# EAGLE design emonDC v0.2 (EAGLE 7.7.0)
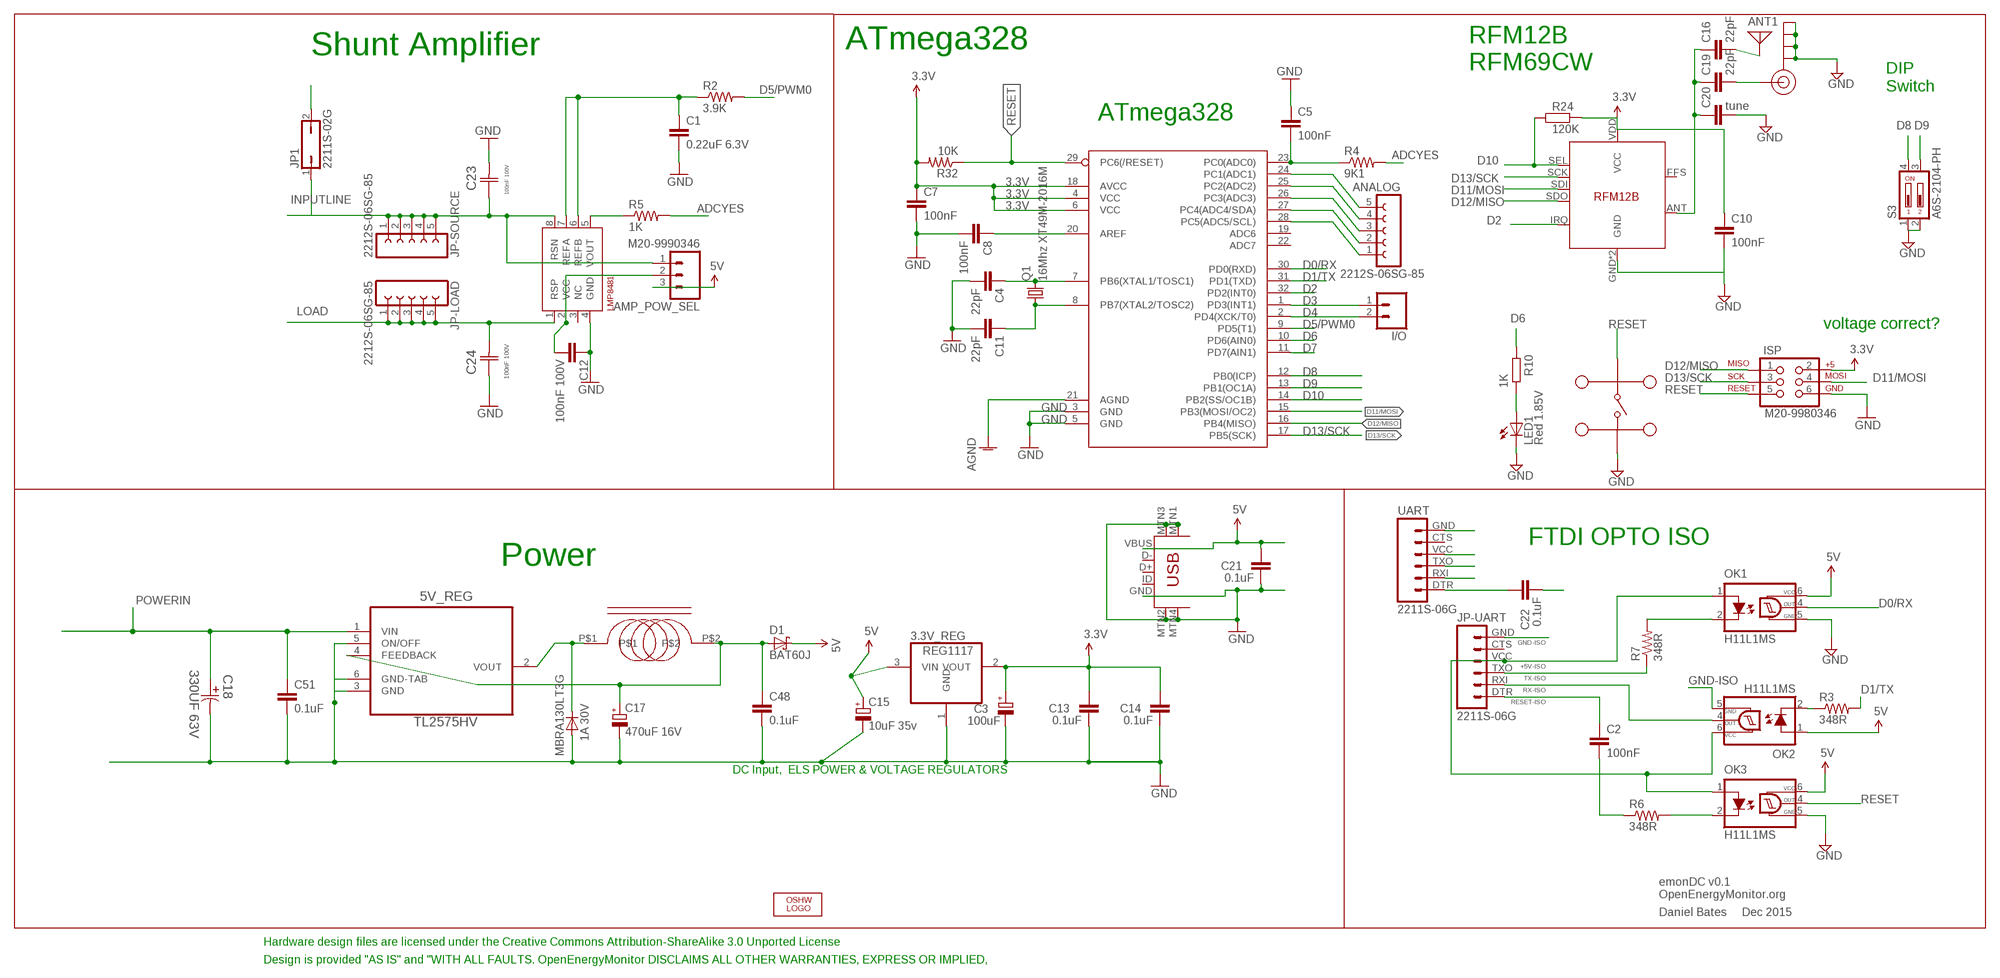
[diagram p0: schematic, sheet 1]

## Parts
3.3V_REG  REG1117  [SOT223]
5V_REG  TL2575HV  TL2575HV-05IKTTR  [TO-263]
AMP_POW_SEL  M20-9990346  M03SMD_RA_FEMALE_NOWRITE  [1X03_SMD_RA_FEMALE_NOWRITE]
ANALOG  2212S-06SG-85  FE05-1  [FE05-1]
ANT1  ANTENNA  [PAD-01]
C1  0.22uF 6.3V  C-EUC0402K  [C0402K]
C2  100nF  C-EUC0402K  [C0402K]
C3  100uF  CPOL-EU153CLV-0605  [153CLV-0605]
C4  22pF  C-EUC0603  [C0603]
C5  100nF  C-EUC0402K  [C0402K]
C7  100nF  C-EUC0402K  [C0402K]
C8  100nF  C-EUC0402K  [C0402K]
C10  100nF  C-EUC0402K  [C0402K]
C11  22pF  C-EUC0603  [C0603]
C12  100nF 100V  C-EUC0805K  [C0805K]
C13  0.1uF  C-EUC0805K  [C0805K]
C14  0.1uF  C-EUC0805K  [C0805K]
C15  10uF 35v  CPOL-EUE1.8-4  [E1,8-4]
C16  22pF  C-EUC0603  [C0603]
C17  470uF 16V  CPOL-EUE3.5-8  [E3,5-8]
C18  330UF 63V  ECA1JHG331-D10XP5  [CAPPR500-1000X2000]
C19  22pF  C-EUC0603  [C0603]
C20  tune  C-EUC0603  [C0603]
C21  0.1uF  C-EUC0805K  [C0805K]
C22  0.1uF  C-EUC0805K  [C0805K]
C23  100nF 100V  T0603F104ZCT  [CAPC1608X85N]
C24  100nF 100V  T0603F104ZCT  [CAPC1608X85N]
C48  0.1uF  C-EUC0805K  [C0805K]
C51  0.1uF  C-EUC0805  [C0805]
D1  BAT60J  [SOD323_ST]
D2  MBRA130LT3G  [DO-214]
I1  SRR0603-331KL  [SRR0603-331KL]
I/O  2212S-02SG-85  M02LOCK  [1X02_LOCK]
ISP  M20-9980346  AVR_SPI_PRG_6PTH  [2X3]
J$1  SMA_EDGE  [SMA-EDGE]
JP1  2211S-02G  JP1Q  [JP1]
JP-LOAD  2212S-06SG-85  FE05-1  [FE05-1]
JP-SOURCE  2212S-06SG-85  FE05-1  [FE05-1]
JP-UART  2211S-06G  FTDI_BASICPTH  [FTDI_BASIC]
LED1  Red 1.85V  LEDCHIP-LED0805  [CHIP-LED0805]
LMP8481  LMP8481SMCLMP8481  [S-PDSO-G08]
LOGO1  OSHW_LOGO_6MILX0200-NT  [OSHW_6X200_NOTEXT]
OK1  H11L1MS  [DIL6-SMD]
OK2  H11L1MS  [DIL6-SMD]
OK3  H11L1MS  [DIL6-SMD]
Q1  16Mhz XT49M-2016M  CRYSTALHC49UP  [HC49UP]
R2  3.9K  R-US_R0603  [R0603]
R3  348R  R-US_R0603  [R0603]
R4  9K1  R-US_R0603  [R0603]
R5  1K  R-US_R0603  [R0603]
R6  348R  R-US_R0603  [R0603]
R7  348R  R-US_R0603  [R0603]
R10  1K  R-EU_R0603  [R0603]
R24  120K  R-EU_R0603  [R0603]
R32  10K  R-US_R0603  [R0603]
RF  RFM12B  [RFM12B]
S3  A6S-2104-PH  2_SMT_DIP_SWITCH  [DIP_SWITCH_SMT]
U1_TQFP  ATMEGA328P  ATMEGA328_SMT  [TQFP32-08]
U$1  MC32882  [SWITCH_TACT_MULTICOMP]
UART  2211S-06G  FTDI_BASICPTH  [FTDI_BASIC]
USB  MUSB-05-S-B-SM-A  USB-MINIB-5PIN  [USB-MINIB-CISECO]

## Nets
3.3V: 3.3V_REG.2(VOUT) C3.+ C7.1 C10.1 C13.1 C14.1 ISP.2 R24.2 R32.2 RF.VDD(VCC) U1_TQFP.4(VCC) U1_TQFP.6(VCC) U1_TQFP.18(AVCC)
5VHIGH [power]: 5V_REG.4(FEEDBACK) C17.+ C48.1 D1.A I1.P$2
5VLOW [power]: 3.3V_REG.3(VIN) AMP_POW_SEL.3 C15.+ C21.1 D1.C OK1.6(VCC) OK2.1(A) OK3.6(VCC) UART.VCC USB.VBUS ; supply symbol labelled 5V
+5V-ISO [power]: JP-UART.VCC OK1.1(A) OK2.6(VCC) OK3.1(A)
ADC1: ANALOG.5 U1_TQFP.24(PC1(ADC1))
ADC2: ANALOG.4 U1_TQFP.25(PC2(ADC2))
ADC3: ANALOG.3 U1_TQFP.26(PC3(ADC3))
ADC4: ANALOG.2 U1_TQFP.27(PC4(ADC4/SDA))
ADC5: ANALOG.1 U1_TQFP.28(PC5(ADC5/SCL))
ADCYES: R4.2 R5.2
AGND [thin_power]: U1_TQFP.21(AGND)
D0/RX: OK1.4(OUT) U1_TQFP.30(PD0(RXD)) UART.TXO
D1/TX: R3.2 U1_TQFP.31(PD1(TXD)) UART.RXI
D2: RF.IRQ U1_TQFP.32(PD2(INT0))
D3: I/O.1 U1_TQFP.1(PD3(INT1))
D4: I/O.2 U1_TQFP.2(PD4(XCK/T0))
D5/PWM0: R2.2 U1_TQFP.9(PD5(T1))
D6: R10.2 U1_TQFP.10(PD6(AIN0))
D7: U1_TQFP.11(PD7(AIN1))
D8: S3.4 U1_TQFP.12(PB0(ICP))
D9: S3.3 U1_TQFP.13(PB1(OC1A))
D9/PWM1: C1.1 LMP8481.6(REFB) LMP8481.7(REFA) R2.1
D10: R24.1 RF.SEL U1_TQFP.14(PB2(SS/OC1B))
D11/MOSI: ISP.4 RF.SDI U1_TQFP.15(PB3(MOSI/OC2))
D12/MISO: ISP.1 RF.SDO U1_TQFP.16(PB4(MISO))
D13/SCK: ISP.3 RF.SCK U1_TQFP.17(PB5(SCK))
DIG1: C16.1 C19.1 C20.1 RF.ANT
GND [thin_power]: 3.3V_REG.1(GND) 5V_REG.3(GND) 5V_REG.5(ON/OFF) 5V_REG.6(GND-TAB) C1.2 C3.- C4.2 C5.1 C7.2 C8.2 C10.2 C11.2 C12.1 C13.2 C14.2 C15.- C17.- C18.2 C20.2 C21.2 C23.2(C2) C24.1(C1) C48.2 C51.2 D2.P$2(A) ISP.6 J$1.GND@0(GND) J$1.GND@1(GND) J$1.GND@2(GND) J$1.GND@3(GND) LED1.C LMP8481.4(GND) OK1.5(GND) OK3.5(GND) RF.GND RF.P$12(GND) S3.1 S3.2 U1_TQFP.3(GND) U1_TQFP.5(GND) U$1.P$3 U$1.P$4 UART.GND USB.GND USB.MTN1(MTN2) USB.MTN2(MTN3) USB.MTN3(MTN1) USB.MTN4
GND-ISO [thin_power]: JP-UART.GND OK2.5(GND)
IND: 5V_REG.2(VOUT) D2.P$1(C) I1.P$1
INPUTLINE: AMP_POW_SEL.1 C23.1(C1) JP1.1 JP-SOURCE.1 JP-SOURCE.2 JP-SOURCE.3 JP-SOURCE.4 JP-SOURCE.5 LMP8481.8(RSN)
LOAD: C24.2(C2) JP-LOAD.1 JP-LOAD.2 JP-LOAD.3 JP-LOAD.4 JP-LOAD.5 LMP8481.1(RSP)
N$1: C4.1 Q1.2 U1_TQFP.7(PB6(XTAL1/TOSC1))
N$2: C5.2 R4.1 U1_TQFP.23(PC0(ADC0))
N$3: C22.1 UART.DTR
N$6: LMP8481.5(VOUT) R5.1
N$7: AMP_POW_SEL.2 C12.2 LMP8481.2(VCC)
N$9: C11.1 Q1.1 U1_TQFP.8(PB7(XTAL2/TOSC2))
N$10: C2.1 JP-UART.DTR
N$11: ANT1.1 C16.2
N$13: OK1.2(C) R7.2
N$15: OK2.2(C) R3.1
N$17: OK3.2(C) R6.2
N$20: C8.1 U1_TQFP.20(AREF)
N$24: C19.2 J$1.SIG(SIGNAL)
N$41: LED1.A R10.1
POWERIN: 5V_REG.1(VIN) C18.1 C51.1 JP1.2
RESET: C22.2 ISP.5 OK3.4(OUT) R32.1 U1_TQFP.29(PC6(/RESET)) U$1.P$1 U$1.P$2
RESET-ISO: C2.2 R6.1
RX-ISO: JP-UART.RXI OK2.4(OUT)
TX-ISO: JP-UART.TXO R7.1
Unconnected: JP-UART.CTS LMP8481.3(NC) RF.FFS U1_TQFP.19(ADC6) U1_TQFP.22(ADC7) UART.CTS USB.D+ USB.D- USB.ID

## Notes on the sheet
- Shunt Amplifier | ATmega328
- RFM12B
  RFM69CW
- DIP
  Switch
- ATmega328
- voltage correct?
- FTDI OPTO ISO
- Power
- DC Input,  ELS POWER & VOLTAGE REGULATORS
- emonDC v0.1
  OpenEnergyMonitor.org
- Daniel Bates     Dec 2015
- Hardware design files are licensed under the Creative Commons Attribution-ShareAlike 3.0 Unported License
- Design is provided "AS IS" and "WITH ALL FAULTS. OpenEnergyMonitor DISCLAIMS ALL OTHER WARRANTIES, EXPRESS OR IMPLIED,

## Library data of the parts
3.3V_REG = burr-brown:REG1117: 800mA and 1A Low Dropout (LDO) Positive Regulator 1.8V, 2.5V, 2.85V, 3.3V, 5V, and Adj; MF: TEXAS INSTRUMENTS; MPN: REG1117; OC_FARNELL: 1097566; OC_NEWARK: 14P6981
5V_REG = TL2575HV:TL2575HV; MF: TEXAS INSTRUMENTS; MPN: LM2575HVS-15/NOPB; OC_FARNELL: 2492609
AMP_POW_SEL = SparkFun-Connectors:M03: Header 3 Standard 3-pin 0.1" header. Use with straight break away headers (SKU : PRT-00116), right angle break away headers (PRT-00553), swiss pins (PRT-00743), machine pins (PRT-00117), and female headers (PRT-00115). Molex polarized connector foot print use with SKU : PRT-08232 with associated crimp pins and housings.; MF: HARWIN; MPN: M20-9990346; OC_FARNELL: 1022249
ANALOG JP-LOAD JP-SOURCE = con-lsta:FE05-1: FEMALE HEADER; MF: MULTICOMP; MPN: 2212S-06SG-85; OC_FARNELL: 1593462; OC_NEWARK: unknown
ANT1 = discrete:ANTENNA: Antenna; OC_FARNELL: unknown
C1 = rcl:C-EU: CAPACITOR, European symbol; MF: AVX; MPN: 04026D224KAT2A; OC_FARNELL: 1327659
C2 C5 C7 C8 C10 = rcl:C-EU: CAPACITOR, European symbol; MF: WALSIN; MPN: 0402X104K100CT; OC_FARNELL: 2496809
C3 = resistor:CPOL-EU: POLARIZED CAPACITOR, European symbol; MF: NICHICON; MPN: UWX0J101MCL1GB; OC_FARNELL: 1823603
C4 C11 = resistor:C-EU: CAPACITOR, European symbol; MF: YAGEO (PHYCOMP); MPN: CC0402JRNPO9BN470; OC_FARNELL: 3019202
C12 = rcl:C-EU: CAPACITOR, European symbol; MF: AVX; MPN: 08051C104K4Z2A; OC_FARNELL: 1833851
C13 C14 C21 C22 C48 = rcl:C-EU: CAPACITOR, European symbol; MF: WALSIN; MPN: 0805B104K160CT; OC_FARNELL: 2496942
C15 = rcl:CPOL-EU: POLARIZED CAPACITOR, European symbol; MF: AVX; MPN: TAJD106K035RNJ; OC_FARNELL: 498956
C16 C19 = rcl:C-EU: CAPACITOR, European symbol; MF: YAGEO (PHYCOMP); MPN: CC0402JRNPO9BN470; OC_FARNELL: 3019202
C17 = rcl:CPOL-EU: POLARIZED CAPACITOR, European symbol; MF: RUBYCON; MPN: 16YXF470MEFC10X12.5; OC_FARNELL: 1144616
C18 = Panasonic-ECA_01:ECA: Aluminum Electrolytic Capacitors/Radial Lead Type; MF: PANASONIC ELECTRONIC COMPONENTS; MPN: ECA1JHG331; OC_FARNELL: unknown; OC_NEWARK: 96K9187; PACKAGE: Radial Lead-TH; SUPPLIER: PANASONIC; TOLERANCE: ±20 %; VALUE: 330UF; VOLTAGERATING: 63V
C20 = rcl:C-EU: CAPACITOR, European symbol; OC_FARNELL: unknown
C23 C24 = Multicomp_By_element14_Batch_1:T0603F104ZCT: CAPACITOR, 0603; MPN: T0603F104ZCT; OC_FARNELL: 9406204; OC_NEWARK: 38K9086; SUPPLIER: Multicomp; TOLERANCE: -20/+80%; VALUE: 100nF; VOLTAGERATING: 25V
C51 = resistor:C-EU: CAPACITOR, European symbol; MF: WALSIN; MPN: 0805B104K160CT; OC_FARNELL: 2496942
D1 = diode:BAT60J: Schottky barrier diode Source: www.st.com, BAT60J.pdf
D2 = CASE 403D Diode:MBRA130LT3G: Fast switching diode; MF: ON SEMICONDUCTOR; MPN: MBRA130LT3G; OC_FARNELL: 9555978
I1 = SRR0603-331KL:SRR0603-331KL: SRR0603-331KL; INDUCTANCE: 330uH; MF: BOURNS; MPN: SRR0603-331KL; OC_FARNELL: 2333890
I/O = SparkFun-Connectors:M02: Standard 2-pin 0.1" header. Use with - straight break away headers ( PRT-00116) - right angle break away headers (PRT-00553) - swiss pins (PRT-00743) - machine pins (PRT-00117) - female headers (PRT-00115) Molex polarized connector foot print use with: PRT-08233 with associated crimp pins and housings. 2.54_SCREWTERM for use with PRT-10571. 3.5mm Screw Terminal footprints for PRT-08084 5mm Screw Terminal footprints for use with PRT-08432; MF: MULTICOMP; MPN: 2212S-02SG-85; OC_FARNELL: 1593458
ISP = SparkFun:AVR_SPI_PRG_6: AVR ISP 6 Pin This is the reduced ISP connector for AVR programming. Common on Arduino. This footprint will take up less PCB space and can be used with a 10-pin to 6-pin adapter such as SKU: BOB-08508; MF: HARWIN; MPN: M20-9980346; OC_FARNELL: 1022231
J$1 = SparkFun-Connectors:SMA_EDGE: SMA Antenna Connector End launch SMA connector. The paste layer has been removed so that the connector can be hand soldered onto the board after reflow.; OC_FARNELL: unknown
JP1 = jumper:JP1Q: JUMPER; MF: MULTICOMP; MPN: 2211S-02G; OC_FARNELL: 1593411
JP-UART UART = SparkFun:FTDI_BASIC: FTDI Basic: 3.3V and 5V; MF: MULTICOMP; MPN: 2211S-06G; OC_FARNELL: 1593415
LED1 = adafruit:LED: LED OSRAM: - CHIPLED LG R971, LG N971, LY N971, LG Q971, LY Q971, LO R971, LY R971 LH N974, LH R974 LS Q976, LO Q976, LY Q976 LO Q996 - Hyper CHIPLED LW Q18S LB Q993, LB Q99A, LB R99A - SideLED LS A670, LO A670, LY A670, LG A670, LP A670 LB A673, LV A673, LT A673, LW A673 LH A674 LY A675 LS A676, LA A676, LO A676, LY A676, LW A676 LS A679, LY A679, LG A679 - Hyper Micro SIDELED® LS Y876, LA Y876, LO Y876, LY Y876 LT Y87S - SmartLED LW L88C, LW L88S LB L89C, LB L89S, LG L890 LS L89K, LO L89K, LY L89K LS L896, LA L896, LO L896, LY L896 - TOPLED LS T670, LO T670, LY T670, LG T670, LP T670 LSG T670, LSP T670, LSY T670, LOP T670, LYG T670 LG T671, LOG T671, LSG T671 LB T673, LV T673, LT T673, LW T673 LH T674 LS T676, LA T676, LO T676, LY T676, LB T676, LH T676, LSB T676, LW T676 LB T67C, LV T67C, LT T67C, LS T67K, LO T67K, LY T67K, LW E67C LS E67B, LA E67B, LO E67B, LY E67B, LB E67C, LV E67C, LT E67C LW T67C LS T679, LY T679, LG T679 LS T770, LO T770, LY T770, LG T770, LP T770 LB T773, LV T773, LT T773, LW T773 LH T774 LS E675, LA E675, LY E675, LS T675 LS T776, LA T776, LO T776, LY T776, LB T776 LHGB T686 LT T68C, LB T68C - Hyper Mini TOPLED® LB M676 - Mini TOPLED Santana® LG M470 LS M47K, LO M47K, LY M47K Source: http://www.osram.convergy.de/; MF: ROHM; MPN: SML-211UTT86K; OC_FARNELL: 1685056
LMP8481 = lmp8481b:LMP8481: LMP8481 - H; MF: TEXAS INSTRUMENTS; MPN: LMP8481MME-S/NOPB; OC_FARNELL: 2322044
LOGO1 = ohw-logo:OSHW_LOGO_6MIL; OC_FARNELL: unknown
OK1-OK3 = optocoupler:H11L*M: 6-Pin DIP Optocoupler Source: http://www.fairchildsemi.com/ds/H1/H11L2-M.pdf; OC_FARNELL: unknown; OC_NEWARK: unknown
Q1 = adafruit:CRYSTAL: CRYSTAL; MF: VISHAY; MPN: XT49M-2016M; OC_FARNELL: 1469641; OC_NEWARK: unknown
R2 = adafruit:R-US_: RESISTOR, American symbol; MF: VISHAY; MPN: CRCW06039K09FKEA; OC_FARNELL: 1152155
R3 R6 R7 = adafruit:R-US_: RESISTOR, American symbol; MF: MULTICOMP; MPN: MC0063W06031348R; OC_FARNELL: 1170742
R4 = adafruit:R-US_: RESISTOR, American symbol; MF: MULTICOMP; MPN: MC01W080559K1; OC_FARNELL: 9334955
R5 = adafruit:R-US_: RESISTOR, American symbol; MF: MULTICOMP; MPN: MC0063W060351K; OC_FARNELL: 9331697
R10 = rcl:R-EU_: RESISTOR, European symbol; MF: MULTICOMP; MPN: MC0063W060351K; OC_FARNELL: 9331697
R24 = rcl:R-EU_: RESISTOR, European symbol; MF: YAGEO (PHYCOMP); MPN: RC0603FR-07120KL; OC_FARNELL: 9238735
R32 = adafruit:R-US_: RESISTOR, American symbol; MF: MULTICOMP; MPN: MC0063W0603510K; OC_FARNELL: 9331700
RF = JeeParts:RFM12B; OC_FARNELL: unknown
S3 = OpenEnergyMonitor:2_SMT_DIP_SWITCH: Multicomp MCEMR-02-T 2 throw SMT DIP switch, Farnell 1524005; MF: OMRON ELECTRONIC COMPONENTS; MPN: A6S2104H; OC_FARNELL: 1960894
U1_TQFP = SparkFun-DigitalIC:ATMEGA328_SMT: 32-Pin Atmega328 part Commonly used on Arduino compatible boards Available in QFP and QFN packages TQFP is IC-09069 QFN is non-stock; MF: ATMEL; MPN: ATMEGA328-AU; OC_FARNELL: 1972086; PROD_ID: IC-09069
U$1 = multicomp tact switch:MC32882
USB = Ciseco USB miniB:USB-MINIB: Mini-USB "B" connector with 5th pin broken out. Created new symbol breaking out 5th "ID" pin in mini/micro USB connector spec. See: http://en.wikipedia.org/wiki/Mini_usb#Cables. Uses same footprint as 4-pin symbol. Also added pins to connect to mounting / shield pads if required (probably not generally needed as signals aren't shielded once they leave the connector). Modified by Ciseco for Rapid Part 24-0357; MF: MOLEX; MPN: 67503-1020; OC_FARNELL: 1125348

## Net classes
2 thin_power: width 0.254 mm

## Board
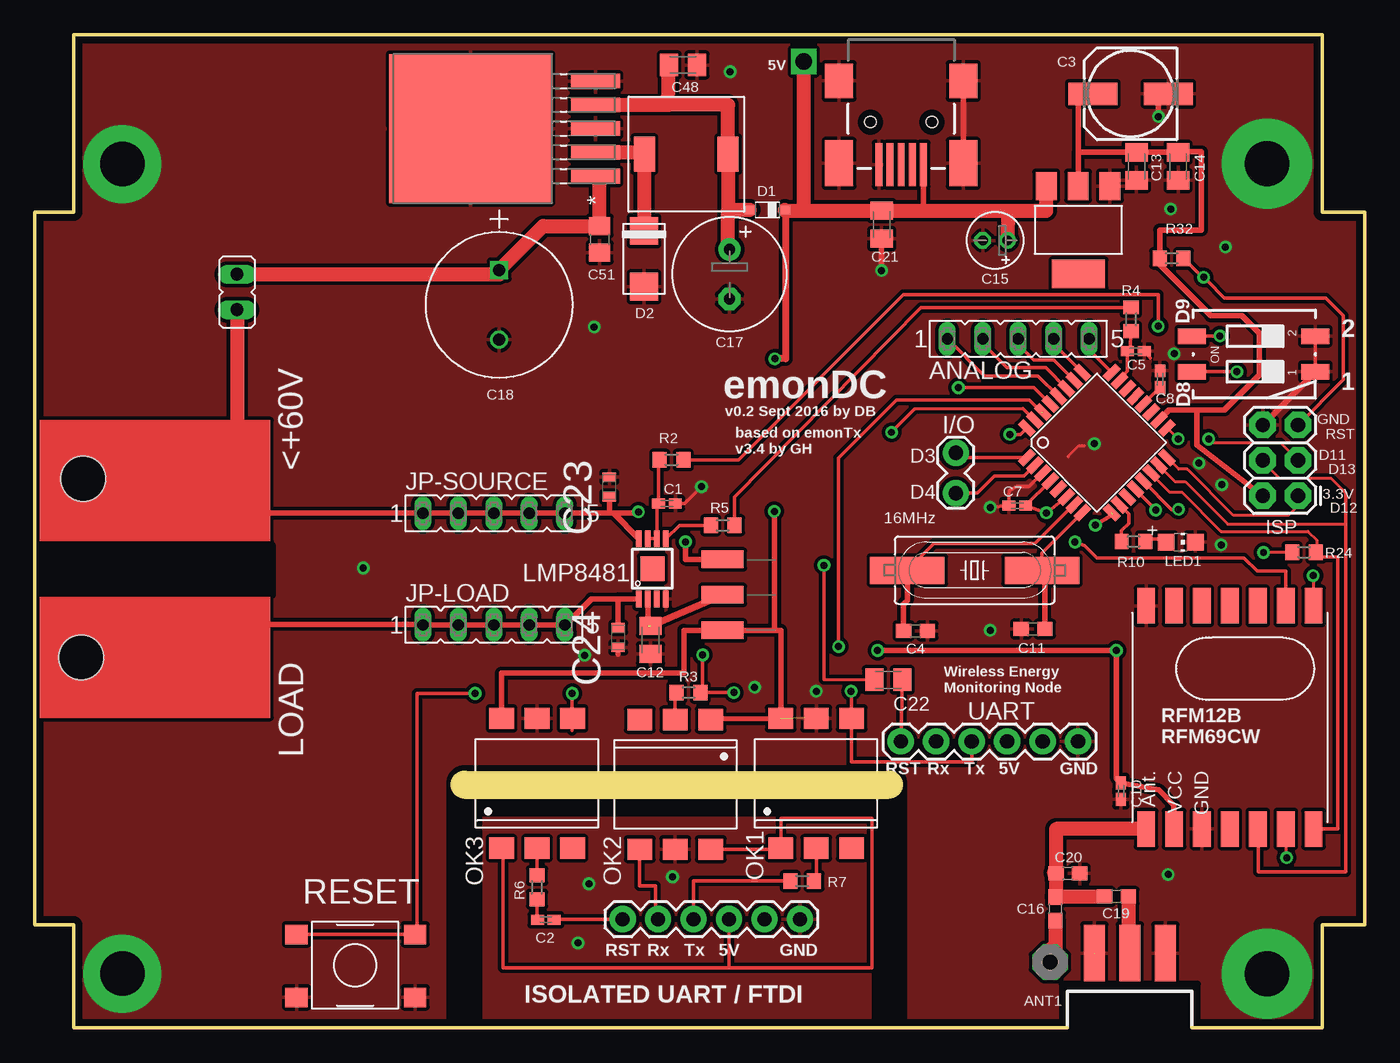
[diagram p1: board, top side]
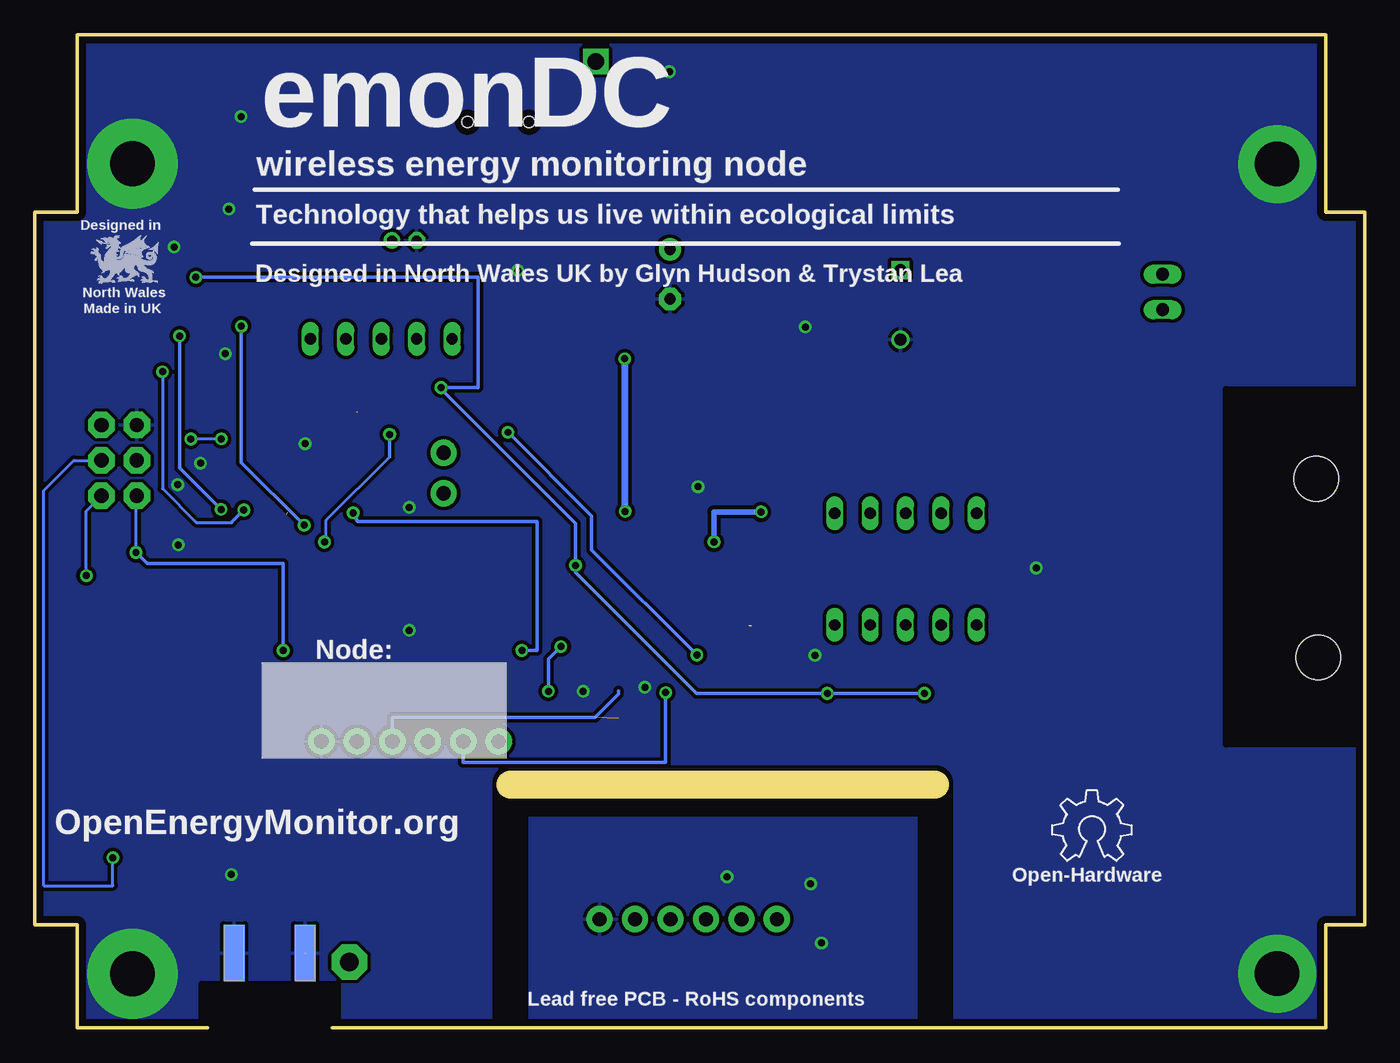
[diagram p2: board, bottom side, seen from below]

Size 95.25 x 71.12 mm. Coordinates in mm from the lower left corner, seen from the top.
Outline: 2.79,0 2.79,7.37 0,7.37 0,58.42 2.79,58.42 2.79,71.12 92.2,71.12 92.2,58.42 95.25,58.42 95.25,7.37 92.2,7.37 92.2,0
Outline: 92.21,0 82.87,0
Outline: 73.97,0 2.79,0
Copper layers (1*16): Top 0.0178mm / dielectric 59mil / Bottom 0.0178mm
Design rules "SSC-EAGLE-2Lyr_v1.0.0.3": minimum track width 6mil, minimum drill 14mil, track to track 6mil, track to pad 6mil, pad to pad 6mil, via to via 6mil, smd to smd 6mil, copper to edge 20mil, drill to drill 16mil, minimum pad ring 8mil, minimum via ring 8mil, stop-mask expansion 3mil, vias tented up to drill 0mil, thermal gap 10mil
Holes 3.2 mm at 3.45,39.32 3.33,26.52
tRestrict: area 0.3,31 to 17,34.5; area 73.6,0.3 to 83.3,3.1; 3 lines
bRestrict: area 0.3,34.8 to 7.1,43.4; area 0.3,22.4 to 7.1,30.7; area 0.3,20.3 to 9.9,45.7; area 73.6,0.3 to 83.3,3.1; 3 lines
Milling: 1 lines

### Footprints (pad centres in the part's own frame; a part is rotated, then mirrored left to right if it is on the bottom)
SOT223 = smd 1.499 x 2.007: 1 -2.261,-3.15; 2 0.025,-3.15; 3 2.311,-3.15 | smd 3.81 x 2.007: 4 0,3.15
TO-263 = smd 1.041 x 3.505: 1 -3.404,-8.788; 2 -1.702,-8.788; 3 0,-8.788; 4 1.702,-8.788; 5 3.404,-8.788 | smd 10.668 x 11.659: 6 0,0.152
1X03_SMD_RA_FEMALE_NOWRITE = smd 1.25 x 3: 1 -2.54,3.415; 2 0,3.415; 3 2.54,3.415
FE05-1 = drill 0.813 long: 1 -5.08,0; 2 -2.54,0; 3 0,0; 4 2.54,0; 5 5.08,0
PAD-01 = drill 1.321 pad 2.54 octagon: 1 0,0
C0402K = smd 0.925 x 0.74: 1 -0.6,0; 2 0.6,0
153CLV-0605 = smd 3.5 x 1.6: + 2.7,0; - -2.7,0
C0603 = smd 1.1 x 1: 1 -0.85,0; 2 0.85,0
C0805K = smd 1.3 x 1.6: 1 -1,0; 2 1,0
E1,8-4 = drill 0.711 pad 1.168: + -0.889,0 | drill 0.711 pad 1.168 octagon: - 0.889,0
E3,5-8 = drill 0.813 pad 1.6: + -1.778,0 | drill 0.813 pad 1.6 octagon: - 1.778,0
CAPPR500-1000X2000 = drill 0.864 square: 1 -5.004,0 | drill 0.864: 2 0,0
CAPC1608X85N = smd 0.66 x 0.94: 1 -0.711,0; 2 0.711,0
C0805 = smd 1.3 x 1.5: 1 -0.95,0; 2 0.95,0
SOD323_ST = smd 0.8 x 0.6: A 1.25,0; C -1.25,0
DO-214 = smd 2 x 2: P$1 -2,0; P$2 2,0
SRR0603-331KL = smd 1.5 x 2.5: P$1 -3,0; P$2 3,0
1X02_LOCK = drill 1.016 pad 1.88: 1 -0.178,0; 2 2.718,0
2X3 = drill 1.016 pad 1.88 octagon: 1 0,0; 2 0,2.54; 3 2.54,0; 4 2.54,2.54; 5 5.08,0; 6 5.08,2.54
SMA-EDGE = smd 1.524 x 4.064: GND@0 0,0; GND@1 5.08,0; SIG 2.54,0 | smd 1.524 x 4.064 bottom: GND@2 0,0; GND@3 5.08,0
JP1 = drill 0.914 long: 1 0,-1.27; 2 0,1.27
FTDI_BASIC = drill 1.016 pad 1.88: CTS 10.16,0; DTR 0,0; GND 12.7,0; RXI 2.54,0; TXO 5.08,0; VCC 7.62,0
CHIP-LED0805 = smd 1.2 x 1.2: A 0,-1.05; C 0,1.05
S-PDSO-G08 = smd 0.4 x 1.2: 1 -0.975,-2.157; 2 -0.325,-2.157; 3 0.325,-2.157; 4 0.975,-2.157; 5 0.975,2.157; 6 0.325,2.157; 7 -0.325,2.157; 8 -0.975,2.157 | smd 1.73 x 1.78: TH 0,0
DIL6-SMD = smd 1.78 x 1.52: 1 -2.54,-4.645; 2 0,-4.645; 3 2.54,-4.645; 4 2.54,4.645; 5 0,4.645; 6 -2.54,4.645
HC49UP = smd 5.334 x 1.93: 1 -4.826,0; 2 4.826,0
R0603 = smd 1 x 1.1: 1 -0.85,0; 2 0.85,0
RFM12B = smd 2.54 x 1.27: ANT 8,-6; FFS -8,2; GND 8,-2; IRQ -8,4; P$8 -8,0; P$9 -8,-2; P$10 -8,-4; P$12 -8,-6; P$16 8,0; SCK 8,4; SDI 8,2; SDO -8,6; SEL 8,6; VDD 8,-4
DIP_SWITCH_SMT = smd 1.1 x 2: 1 -1.27,-4.215; 2 1.27,-4.215; 3 1.27,4.615; 4 -1.27,4.615
TQFP32-08 = smd 1.27 x 0.559: 1 -4.293,2.8; 2 -4.293,2; 3 -4.293,1.2; 4 -4.293,0.4; 5 -4.293,-0.4; 6 -4.293,-1.2; 7 -4.293,-2; 8 -4.293,-2.8; 17 4.293,-2.8; 18 4.293,-2; 19 4.293,-1.2; 20 4.293,-0.4; 21 4.293,0.4; 22 4.293,1.2; 23 4.293,2; 24 4.293,2.8 | smd 0.559 x 1.27: 9 -2.8,-4.293; 10 -2,-4.293; 11 -1.2,-4.293; 12 -0.4,-4.293; 13 0.4,-4.293; 14 1.2,-4.293; 15 2,-4.293; 16 2.8,-4.293; 25 2.8,4.293; 26 2,4.293; 27 1.2,4.293; 28 0.4,4.293; 29 -0.4,4.293; 30 -1.2,4.293; 31 -2,4.293; 32 -2.8,4.293
SWITCH_TACT_MULTICOMP = smd 1.6 x 1.4: P$1 -1.1,5.3; P$2 7.4,5.3; P$3 -1.1,0.8; P$4 7.4,0.8
USB-MINIB-CISECO = smd 3.1 x 0.5: D+ 8.25,0; D- 8.25,0.8; GND 8.25,-1.6; ID 8.25,-0.8; VBUS 8.25,1.6 | smd 2.5 x 2: MTN1 2.25,4.45; MTN3 2.25,-4.45 | smd 3.3 x 2: MTN2 8.15,4.45; MTN4 8.15,-4.45 | hole 0.8: 5.2,2.2; 5.2,-2.2

### Placement (x,y rotation side)
3.3V_REG  74.76,57.15 180 top
5V_REG  31.36,64.4 90 top
AMP_POW_SEL  45.85,31 270 top
ANALOG  70.44,49.35 0 top
ANT1  72.72,4.7 0 top
C1  45.27,37.55 0 top
C2  36.59,7.73 180 top
C3  78.49,66.9 180 top
C4  63.08,28.42 0 top
C5  78.86,48.47 180 top
C7  70.37,37.4 180 top
C8  80.59,46.46 90 top
C10  77.8,16.95 270 top
C11  71.5,28.56 180 top
C12  44.1,27.77 90 top
C13  78.91,61.7 270 top
C14  81.89,61.7 270 top
C15  68.79,56.4 180 top
C16  73.1,8.51 270 top
C17  49.76,53.98 270 top
C18  33.25,49.28 270 top
C19  77.47,9.4 0 top
C20  73.99,11.05 0 top
C21  60.66,57.53 270 top
C22  61.14,24.92 180 top
C23  41.15,38.73 90 top
C24  41.78,27.94 90 top
C48  46.43,68.96 0 top
C51  40.45,56.48 270 top
D1  52.47,58.59 180 top
D2  43.63,55.08 270 top
I1  46.66,62.57 0 top
I/O  65.97,41 270 top
ISP  90.49,38.1 90 top
J$1  80.98,5.33 180 top
JP1  14.48,52.7 0 top
JP-LOAD  32.88,28.85 0 top
JP-SOURCE  32.88,36.85 0 top
JP-UART  42.1,7.77 0 top
LED1  82.08,34.77 270 top
LMP8481  44.23,32.87 0 top
LOGO1  22.37,11.94 0 bottom
OK1  55.97,17.5 0 top
OK2  45.87,17.43 180 top
OK3  35.97,17.5 0 top
Q1  67.31,32.77 180 top
R2  45.6,40.67 0 top
R3  46.82,24.01 0 top
R4  78.52,50.75 90 top
R5  49.27,35.99 0 top
R6  35.97,10.05 90 top
R7  54.97,10.5 0 top
R10  78.69,34.83 180 top
R24  90.92,34.05 180 top
R32  81.42,55.11 180 top
RF  85.6,22.23 270 top
S3  87.5,48.26 90 top
U1_TQFP  76.07,41.91 45 top
U$1  19.84,1.37 0 top
UART  62.03,20.5 0 top
USB  62.05,70.07 270 top

### Tracks (layer width: path | path; a pad name or v marks a point on that pad's centre or on a via)
3.3V  (via drill 0.5)  (1 unrouted)
  Top 0.203: R24.2 88.03,34.05 v88.01,34.04 | U1_TQFP.4 72.81,39.16 72.87,39.19 72.92,39.32 | 80.48,43.48 U1_TQFP.18 | 73.91,38 U1_TQFP.6
  Top 0.254: U1_TQFP.4 C7.1 v72.46,36.88 U1_TQFP.6 | R32.2 80.57,54.65 | 81.22,44.25 81.22,44.23 | v77.47,27.03 77.47,27
  Top 0.406: RF.VDD 81.6,15.94 80.52,17.02 C10.1 77.47,17.87 v77.47,27.03 v77.47,27.02 v60.37,27.02 | 73.89,38.07 U1_TQFP.6 | 80.57,54.65 84.22,51 86.47,51 87.72,49.75 87.72,46.75 85.22,44.25 83.22,44.25 | 83.22,44.25 81.22,44.25 | 81.22,44.23 U1_TQFP.18 | 3.3V_REG.2 74.73,62.7 | 74.73,62.7 C13.1 C14.1 81.39,62.75 83.56,62.75 83.57,57.15 80.57,57.15 R32.2 | C3.+ 74.73,66.9 74.73,62.7 | ISP.2 83.22,41.75 83.22,44.25
  Bottom 0.203: v88.01,34.04 88.01,38.04 ISP.2
  Bottom 0.254: v72.46,36.88 72.14,36.27 59.27,36.27 59.27,27.02 v60.37,27.02 | 87.99,34.04 87.2,33.25 77.47,33.25 v77.47,27.03
5VHIGH
  Top 1.016: 5V_REG.4 45.36,66.11 | 45.36,66.11 C48.1 | 45.36,66.11 49.66,66.11 I1.P$2 49.66,58.59 | 49.66,58.59 D1.A | C17.+ arc-90 49.66,55.85 49.66,58.59
5VLOW  (via drill 0.5, 1.2)  (1 unrouted)
  Top 0.406: USB.VBUS 63.65,58.53 64.01,58.53 | v52.97,37 v52.97,36.99 52.97,28.46 | 52.97,28.46 AMP_POW_SEL.3 46.48,28.46 46.48,25.4 33.43,25.4 OK3.6 | 52.97,28.46 53.43,28.46 OK1.6 48.53,22.13
  Top 0.5: 48.53,22.13 OK2.1
  Top 0.508: 53.78,58.53 53.78,47.91 v53,47.91
  Top 1.016: 55.07,58.53 55.27,58.53 | 55.27,58.53 C21.1 64.01,58.53 69.7,58.53 | 69.7,58.53 C15.+ | 69.7,58.53 72.44,58.53 3.3V_REG.3 | v55.07,69.22 55.07,58.53 | 55.27,58.59 55.27,58.53 | D1.C arc90 53.78,58.53 55.07,58.53
  Bottom 0.254: UART.VCC 69.65,22.23 55.12,22.23 53.43,23.91 53.43,24.13
  Bottom 0.508: v53,47.91 53,36.99 v52.97,36.99
+5V-ISO
  Top 0.254: JP-UART.VCC 49.72,4.27 | 49.72,4.27 33.53,4.27 33.53,12.8 OK3.1 | 49.72,4.27 59.94,4.27 59.94,14.99 53.43,14.99 OK1.1 53.45,12.79 OK2.6
ADC1
  Top 0.203: U1_TQFP.24
  Top 0.254: ANALOG.5 75.52,48.53 U1_TQFP.24
ADC2
  Top 0.203: U1_TQFP.25 75.02,46.9 74.93,46.99
  Top 0.254: U1_TQFP.25 72.98,48.96 ANALOG.4
ADC3
  Top 0.203: U1_TQFP.26 74.45,46.33 74.3,46.48
  Top 0.254: U1_TQFP.26 72.98,47.83 71.55,47.83 70.44,48.94 ANALOG.3
ADC4
  Top 0.203: U1_TQFP.27 73.89,45.75 73.79,45.85
  Top 0.254: U1_TQFP.27 72.41,47.27 69.62,47.27 67.9,48.99 ANALOG.2
ADC5
  Top 0.203: U1_TQFP.28 73.32,45.17 73.28,45.21
  Top 0.254: U1_TQFP.28 71.86,46.69 68.03,46.69 ANALOG.1
ADCYES
  Top 0.254: R4.2 63.47,51.6 50.12,38.02 R5.2
AGND
  Top 0.203: U1_TQFP.21 78.78,45.2 78.84,45.15
D0/RX  (via drill 0.5)  (1 unrouted)
  Top 0.203: 72.19,44.02 72.14,44.07
  Top 0.254: 72.14,44.07 71.26,44.95 61.72,44.95 57.57,40.8 v57.57,27.3 | v58.47,24.1 58.51,24.06 OK1.4 58.51,19.02 67.11,19.02 UART.TXO
  Bottom 0.254: v57.57,27.3 58.47,26.4 v58.47,24.1
D1/TX  (via drill 0.5)
  Top 0.254: v61.37,42.65 63.02,44.3 70.77,44.35 71.54,43.58 U1_TQFP.31 | v47.83,26.7 47.83,24.16 R3.2 v50.06,24
  Bottom 0.254: v61.37,42.65 55.37,36.65 55.37,34.23 v47.83,26.7 | UART.RXI 64.57,19 50.06,19 v50.06,24
D2  (via drill 0.5)
  Top 0.254: RF.IRQ 89.6,32.7 87.57,32.7 86.61,33.66 76.07,33.66 75.18,34.54 v74.51,34.79 | v69.84,42.5 70.59,42.5 U1_TQFP.32
  Bottom 0.203: 74.3,34.8 v74.51,34.79 74.42,34.67 74.42,36.32 69.85,40.9
  Bottom 0.254: v69.84,42.5 69.85,42.12 69.85,40.9
D3
  Top 0.254: U1_TQFP.1 66.29,40.85 I/O.1
D4
  Top 0.203: U1_TQFP.2 71.62,40.33 71.63,40.34
  Top 0.254: U1_TQFP.2 70.84,39.5 68.72,39.5 67.5,38.28 I/O.2
D5/PWM0  (via drill 0.5)  (1 unrouted)
  Top 0.203: 77.01,37.04 U1_TQFP.9
  Top 0.254: v75.97,36 77.22,36.75 | v80.47,50.25 80.47,52.5 62.23,52.5 50.41,40.67 R2.2
  Bottom 0.254: v75.97,36 80.47,40.5 v80.47,50.25
D6
  Top 0.254: U1_TQFP.10 78.37,36.79 78.37,36.12 77.84,35.6 R10.2
D7
  Top 0.203: U1_TQFP.11 78.26,38.07 78.21,38.08
D8  (via drill 0.5)
  Top 0.203: U1_TQFP.12 78.83,38.65 78.79,38.63
  Top 0.254: S3.4 v86.11,46.99 | U1_TQFP.12 78.83,38.55 v80.29,37.08
  Bottom 0.203: v86.11,46.99 86.11,38.61 83.69,36.2 81.15,36.2
  Bottom 0.254: v80.29,37.08 81.15,36.22 81.15,36.2
D9  (via drill 0.5)
  Top 0.203: U1_TQFP.13 79.39,39.23 79.38,39.14
  Top 0.254: S3.3 82.91,49.55 v84.89,49.55 | v81.92,37.13 81.41,37.13 U1_TQFP.13
  Bottom 0.254: v81.92,37.13 84.89,40.11 v84.89,49.55
D9/PWM1
  Top 0.254: R2.1 44.67,40.67 C1.1 44.56,37.55 LMP8481.6 LMP8481.7
D10
  Top 0.203: 91.77,33.71 R24.1 91.82,34.1 91.82,34.92 91.19,35.56 84.96,35.56 82.17,38.35 81.28,38.35 79.96,39.68 U1_TQFP.14 79.91,39.72 79.93,39.83
  Top 0.254: RF.SEL 93.34,14.22 93.34,33.71 91.77,33.71
D11/MOSI
  Top 0.203: ISP.4 87.95,40.58 89.15,39.37 92.84,39.37 93.73,38.48 | 87.59,13.58 RF.SDI | 80.47,40.36 80.49,40.29 U1_TQFP.15 80.52,40.25 81.66,39.12 82.4,39.12 85.45,36.07 93.9,36.07
  Top 0.254: 87.59,13.58 87.63,13.58 87.63,11.18 93.9,11.18 93.9,36.07 93.9,38.31 93.73,38.48
D12/MISO  (via drill 0.5)
  Top 0.203: RF.SDO 91.6,32.35 v91.57,32.38 | ISP.1 90.49,37.4 89.79,36.7 85.85,36.7 82.55,40.01 81.94,40.01 U1_TQFP.16 81.04,40.93
  Bottom 0.203: v91.57,32.38 91.57,37.02 ISP.1
D13/SCK  (via drill 0.5)
  Top 0.203: RF.SCK 89.6,12.48 v89.66,12.18 | v81.89,42.18 81.11,42.97 U1_TQFP.17 81.04,42.87 | v84.08,42.17 84.2,41.92 84.14,41.92 89.22,41.91 ISP.3
  Bottom 0.203: ISP.3 92.46,40.64 94.62,38.48 94.62,10.16 89.66,10.16 v89.66,12.18 | v81.89,42.18 v84.08,42.17
DIG1
  Top 1.016: RF.ANT 73.14,14.22 C20.1 73.14,9.36 C16.1 73.1,9.4 C19.1
  Top 1.143: C20.1 arc-90 73.07,11.12
GND  (via drill 0.5, 3.2 pad 5.59, 3.2 pad 6.45)  (1 unrouted)
  Top 0.203: 74,40.91 74.79,41.7 75.21,41.7
  Top 0.254: U1_TQFP.3 71.22,38.75 70.34,38.75 69.81,38.47 69.77,38.17 C7.2 v68.43,37.28 | 79.92,47.95 C5.1 | S3.1 S3.2 | C1.2 46.55,37.55 v47.75,38.75
  Top 0.406: USB.MTN1 USB.MTN2 | C21.2 v60.66,54.25 | C3.- 80.48,66.9 v80.48,65.28 | 81.34,60.7 C14.2 | S3.1 91.72,46.95 ISP.6 | C24.1 41.78,26.77
  other vias: 75.9,41.83 55.97,24.1 6.27,61.88 40.06,50.2 81.36,58.64 81.61,48.27 68.44,28.46 88.26,61.89 51.56,24.38 81.18,10.97 49.81,68.48 39.37,26.67 84.98,34.59 83.39,40.44 85.03,38.9 85.28,55.93 6.27,3.87 88.26,3.86 23.52,32.93
  pour Bottom (isolate 0.254): 3.05,70.87 3.05,58.17 0.25,58.17 0.25,7.62 3.05,7.62 3.05,0.25 91.95,0.25 91.95,7.62 95,7.62 95,58.17 91.95,58.17 91.95,70.87
  pour Top (isolate 0.254): 3.05,70.87 3.05,58.17 0.25,58.17 0.25,7.62 3.05,7.62 3.05,0.25 91.95,0.25 91.95,7.62 95,7.62 95,58.17 91.95,58.17 91.95,70.87
GND-ISO  (via drill 0.5)
  other vias: 45.68,10.8 38.91,6.06 39.68,10.3
  pour Top (isolate 0.254): 31.75,14.99 60.2,14.99 60.2,0.25 31.75,0.25
  pour Bottom (isolate 0.254): 31.74,14.98 60.07,15 60.2,0.31 31.75,0.31
IND
  Top 1.016: 43.41,62.85 I1.P$1 | 5V_REG.2 43.66,62.7 I1.P$1 | I1.P$1 43.63,62.57 D2.P$1
INPUTLINE  (via drill 0.5)
  Top 0.406: 43.25,35.09 LMP8481.8 41.44,36.85 | 49.27,33.53 AMP_POW_SEL.1 46.61,33.54 v46.61,34.8 | 16.38,36.83 16.38,36.85 JP-SOURCE.1 JP-SOURCE.2 JP-SOURCE.3 JP-SOURCE.4 JP-SOURCE.5 41.15,36.85 | 41.15,36.85 C23.1 | 41.15,36.85 41.44,36.85 | v43.23,36.95 43.23,36.85 41.44,36.85
  Top 1.016: JP1.1 14.48,36.83 16.38,36.83
  Bottom 0.406: v43.23,36.95 46.61,36.96 v46.61,34.8
LOAD
  Top 0.406: JP-LOAD.1 JP-LOAD.2 JP-LOAD.3 JP-LOAD.4 JP-LOAD.5 37.98,28.82 39.87,30.72 41.78,30.72 | LMP8481.1 43.22,30.72 41.78,30.72 | 41.78,30.72 C24.2
N$1
  Top 0.203: 74.42,37.43 U1_TQFP.7
  Top 0.254: U1_TQFP.7 74.42,37.46 71.63,34.67 64.39,34.67 Q1.2
  Top 0.406: Q1.2 62.48,30.61 62.23,30.35 62.23,29.5 C4.1
N$2
  Top 0.203: U1_TQFP.23 77.69,46.33 77.67,46.33
  Top 0.254: 78.72,49.83 R4.1 78.47,48.59 C5.2 78.26,47.02 77.69,46.4 U1_TQFP.23
N$3
  Top 0.254: UART.DTR 62.05,20.5 C22.1
N$6
  Top 0.254: LMP8481.5 46.16,35.99 R5.1
N$7  (1 unrouted)
  Top 0.406: LMP8481.2 43.91,28.77
  Top 0.5: AMP_POW_SEL.2 C12.2
N$9
  Top 0.203: 75.09,36.94 U1_TQFP.8
  Top 0.254: Q1.1 72.14,34.01 U1_TQFP.8
  Top 0.406: C11.1 72.35,32.55 Q1.1
N$10
  Top 0.254: C2.1 37.19,7.77 JP-UART.DTR
N$11
  Top 1.016: C16.2 73.1,4.7 ANT1.1
  Top 1.143: 72.85,5.59 arc-90 ANT1.1
N$13
  Top 0.254: OK1.2 55.97,10.5 R7.2
N$15
  Top 0.254: R3.1 45.87,23.88 OK2.2
N$17
  Top 0.254: OK3.2 R6.2
N$20
  Top 0.203: U1_TQFP.20 79.33,44.66 79.35,44.6
  Top 0.254: U1_TQFP.20 80.61,45.88 C8.1
N$24
  Top 1.016: C19.2 78.32,6.75 78.44,6.75
  Top 1.27: J$1.SIG 78.44,6.75
N$31
  Top 0.406: 27.6,28.9 16.08,28.9
N$41
  Top 0.254: R10.1 79.74,35.02 80.78,35.02 LED1.A
POWERIN
  Top 1.016: 5V_REG.1 40.45,61 C51.1 36.4,57.43 C18.1 33.25,53.98 JP1.2
RESET  (via drill 0.5)
  Top 0.203: U1_TQFP.29 72.81,44.66 72.77,44.7
  Top 0.254: R32.1 83.47,53.91 v83.72,53.75 83.97,53.5 85.22,52.25 92.47,52.25 93.72,51 93.72,46.41 ISP.5 | U1_TQFP.29 71.57,45.85 v66.16,45.85 | v31.53,23.95 27.39,23.95 27.39,6.67 U$1.P$2 U$1.P$1 | v38.49,23.95 38.49,21.31 OK3.4 | C22.2 56.52,24.95 v56.52,33.12
  Bottom 0.254: v31.53,23.95 v38.49,23.95 47.86,23.95 56.52,32.6 v56.52,33.12 56.52,36.1 66.27,45.85 v66.16,45.85 63.51,45.85 63.51,53.75 v83.72,53.75
RESET-ISO
  Top 0.254: R6.1 35.97,7.73 C2.2
RX-ISO
  Top 0.254: OK2.4 43.33,10.16 44.45,10.16 44.45,7.77 JP-UART.RXI
TX-ISO
  Top 0.254: R7.1 47.18,10.5 JP-UART.TXO
(copper drawn outside any net)
  shapes: Top area x3

### Text on the board
tPlace: GND | RST | D11 | D3 | D13 | D4 | 3.3V | D12
bPlace: emonDC | wireless energy monitoring node | Technology that helps us live within ecological limits | Designed in | Designed in North Wales UK by Glyn Hudson & Trystan Lea | North Wales | Made in UK | Node: | OpenEnergyMonitor.org | Open-Hardware | Lead free PCB - RoHS components
tNames: D2 | <+60V | 16MHz | LOAD | RESET
tDocu: +60V | POWER | 5V
tSilk: 5V | D9 | 2 / / 1 | emonDC | v0.2 Sept 2016 by DB | D8 | based on emonTx / v3.4 by GH | Wireless Energy / Monitoring Node | RFM12B / RFM69CW | RST | Rx | Tx | 5V | GND | RST | Rx | Tx | 5V | GND | ISOLATED UART / FTDI
_tsilk: Designed in | North Wales | Made in UK
_bsilk: SMT V0.6 rev3 | emonTx | wireless energy monitoring node | SMT V0.6 rev3 | emonTx | SMT V0.6 rev3 | emonTx | Technology that helps us live within ecological limits | wireless energy monitoring node | wireless energy monitoring node | Designed in North Wales UK by Glyn Hudson & Trystan Lea | Technology that helps us live within ecological limits | Technology that helps us live within ecological limits | Designed in North Wales UK by Glyn Hudson & Trystan Lea | 165mm ant | 433Mhz | Designed in North Wales UK by Glyn Hudson & Trystan Lea | 165mm ant | 165mm ant | 433Mhz | 433Mhz | 868Mhz | 82mm ant | 82mm ant | 82mm ant | 868Mhz | 868Mhz | 78mm ant | 915Mhz | 78mm ant | 915Mhz | 78mm ant | 915Mhz | 165mm ant | 433Mhz | 82mm ant | 868Mhz | 78mm ant | 915Mhz